# Altium schematic sheet Root.SchDoc
size B
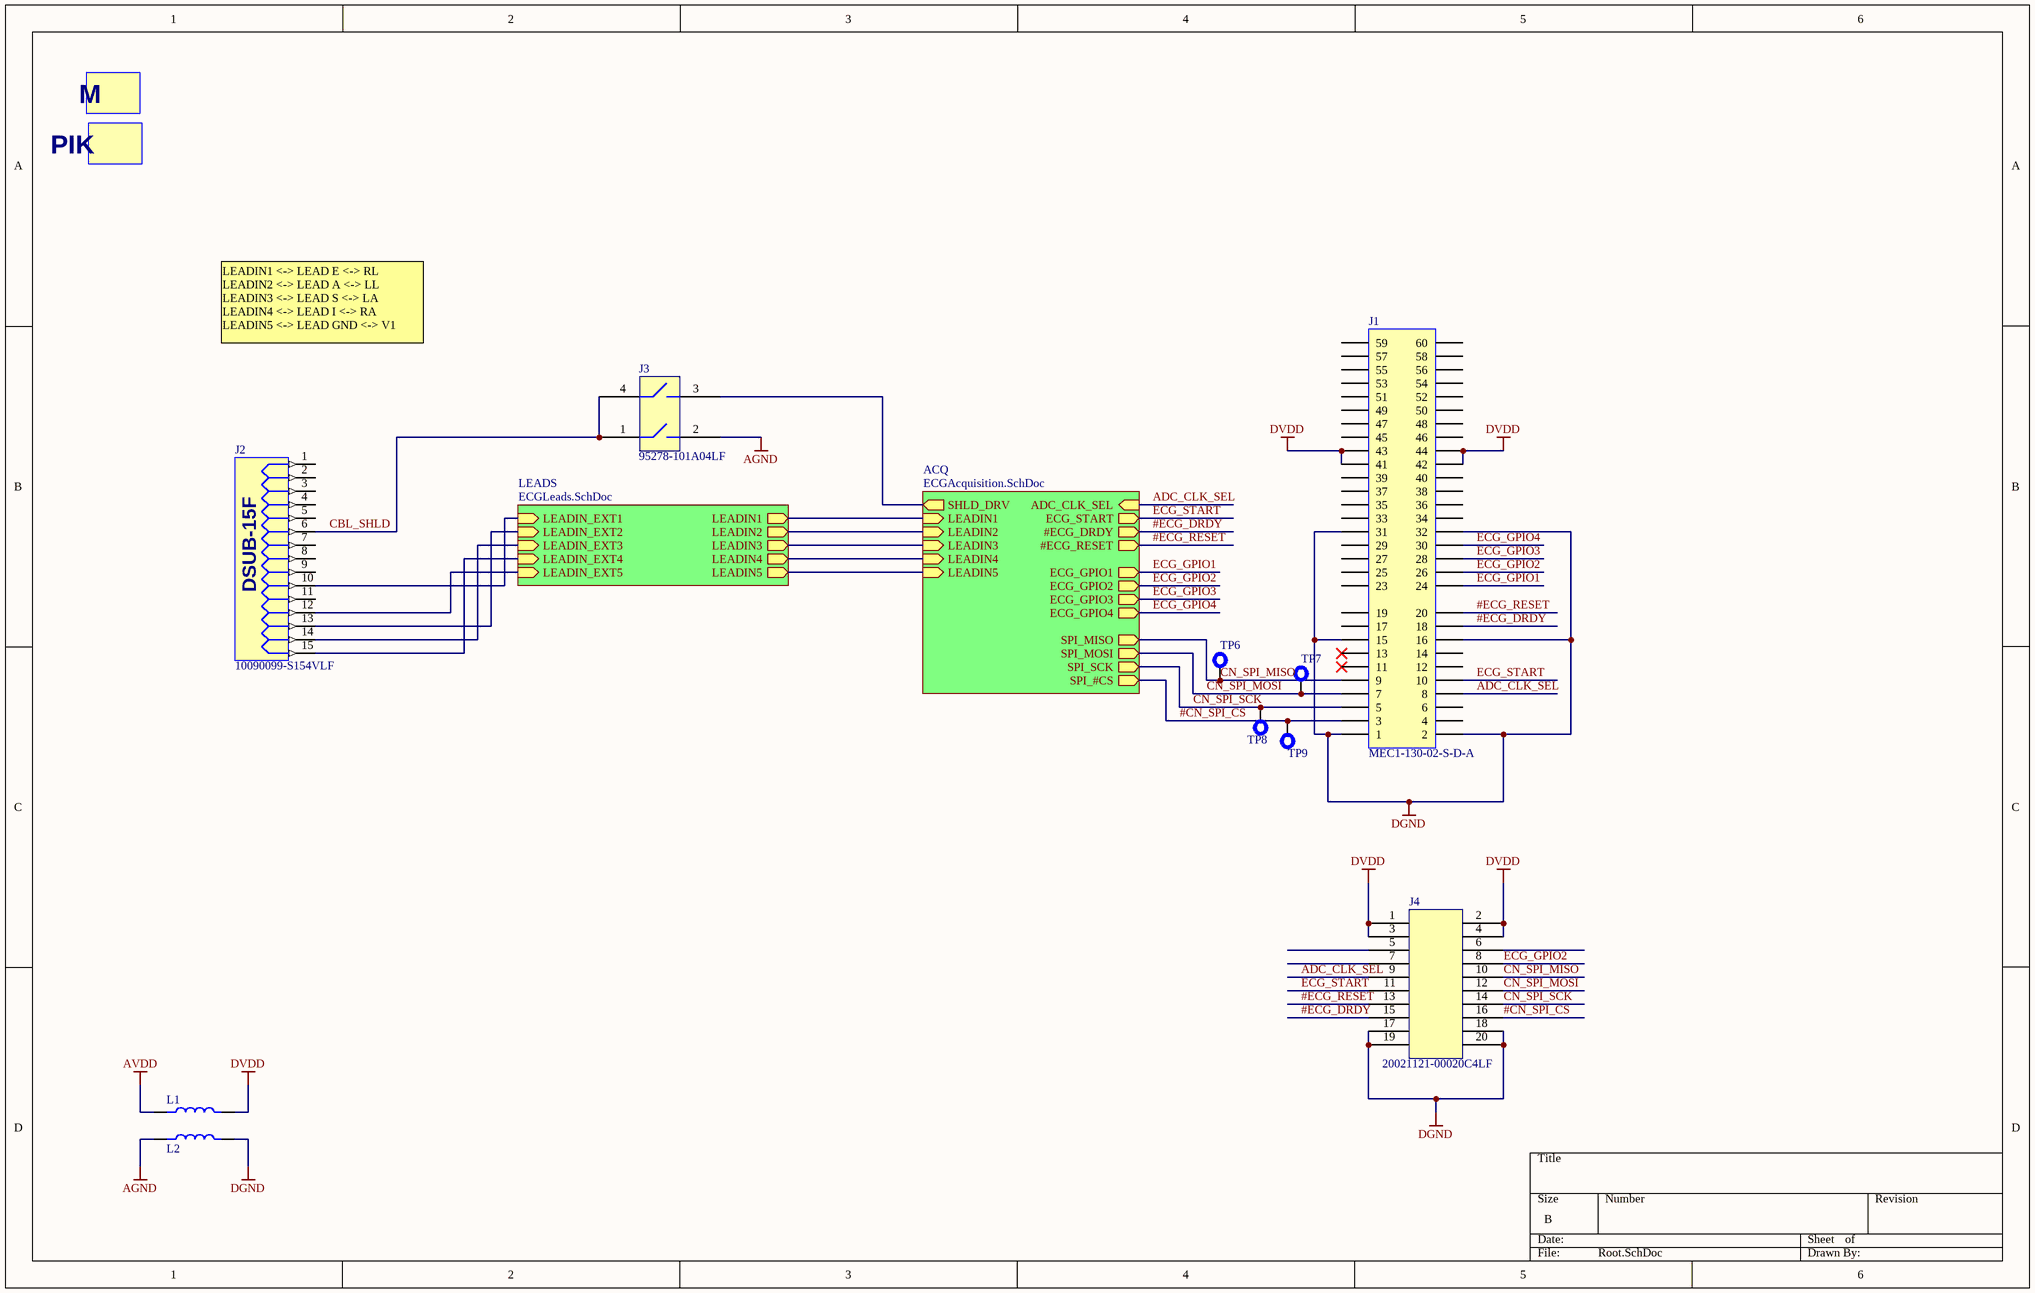
[diagram p0: Root.SchDoc]

## Parts
J1  MEC1-130-02-S-D-A  [MEC1-130-02-S-D-A]
J2  10090099-S154VLF  [10090099-S154VLF]
J3  95278-101A04LF  [95278-101A04LF]
J4  20021121-00020C4LF  [20021121-00020C4LF]
L1  IND_GEN  [IND_0603]  (value not drawn)
L2  IND_GEN  [IND_0603]  (value not drawn)
OV1  MINNESOTA_OVERLAY  [Minnesota]  (value not drawn)
OV2  PIKACHU_OVERLAY  [PIKACHU]  (value not drawn)
TP6  TEST_PT_40MIL  [TP_40MIL]  (value not drawn)
TP7  TEST_PT_40MIL  [TP_40MIL]  (value not drawn)
TP8  TEST_PT_40MIL  [TP_40MIL]  (value not drawn)
TP9  TEST_PT_40MIL  [TP_40MIL]  (value not drawn)

## Sub-sheets
ACQ = ECGAcquisition.SchDoc: SPI_MISO (out), SPI_SCK (out), SPI_#CS (out), SPI_MOSI (out), ADC_CLK_SEL (in), ECG_START (out), #ECG_DRDY (out), #ECG_RESET (out), ECG_GPIO1 (out), ECG_GPIO2 (out), ECG_GPIO3 (out), ECG_GPIO4 (out), LEADIN2 (in), LEADIN3 (in), LEADIN4 (in), LEADIN1 (in), LEADIN5 (in), SHLD_DRV (out)
LEADS = ECGLeads.SchDoc: LEADIN_EXT1 (in), LEADIN_EXT2 (in), LEADIN_EXT3 (in), LEADIN_EXT4 (in), LEADIN_EXT5 (in), LEADIN1 (out), LEADIN2 (out), LEADIN3 (out), LEADIN4 (out), LEADIN5 (out)

## Nets
AGND: J3.2 L2.1
AVDD: L1.1
DGND: J1.1 J1.2 J1.15 J1.16 J1.31 J1.32 J4.17 J4.18 J4.19 J4.20 L2.2
DVDD: J1.41 J1.42 J1.43 J1.44 J4.1 J4.2 J4.3 J4.4 L1.2
#CN_SPI_CS: J1.3 J4.16 TP9.1 ; sheet ACQ/SPI_#CS
#ECG_DRDY: J1.18 J4.15 ; sheet ACQ/#ECG_DRDY
#ECG_RESET: J1.20 J4.13 ; sheet ACQ/#ECG_RESET
ADC_CLK_SEL: J1.8 J4.9 ; sheet ACQ/ADC_CLK_SEL
CBL_SHLD: J2.6 J3.1 J3.4
CN_SPI_MISO: J1.9 J4.10 TP6.1 ; sheet ACQ/SPI_MISO
CN_SPI_MOSI: J1.7 J4.12 TP7.1 ; sheet ACQ/SPI_MOSI
CN_SPI_SCK: J1.5 J4.14 TP8.1 ; sheet ACQ/SPI_SCK
ECG_GPIO1: J1.24 ; sheet ACQ/ECG_GPIO1
ECG_GPIO2: J1.26 J4.8 ; sheet ACQ/ECG_GPIO2
ECG_GPIO3: J1.28 ; sheet ACQ/ECG_GPIO3
ECG_GPIO4: J1.30 ; sheet ACQ/ECG_GPIO4
ECG_START: J1.10 J4.11 ; sheet ACQ/ECG_START
NetJ2_10: J2.10 ; sheet LEADS/LEADIN_EXT1
NetJ2_12: J2.12 ; sheet LEADS/LEADIN_EXT5
NetJ2_13: J2.13 ; sheet LEADS/LEADIN_EXT2
NetJ2_14: J2.14 ; sheet LEADS/LEADIN_EXT3
NetJ2_15: J2.15 ; sheet LEADS/LEADIN_EXT4
NetJ3_3: J3.3 ; sheet ACQ/SHLD_DRV
(unnamed): sheet LEADS/LEADIN1, sheet ACQ/LEADIN1
(unnamed): sheet LEADS/LEADIN2, sheet ACQ/LEADIN2
(unnamed): sheet LEADS/LEADIN3, sheet ACQ/LEADIN3
(unnamed): sheet LEADS/LEADIN4, sheet ACQ/LEADIN4
(unnamed): sheet LEADS/LEADIN5, sheet ACQ/LEADIN5

Not connected (* = marked no-connect by the designer): J1 4 6 11* 12 13* 14 17 19 23 25 27 29 33 34 35 36 37 38 39 40 45 46 47 48 49 50 51 52 53 54 55 56 57 58 59 60; J2 1 2 3 4 5 7 8 9 11; J4 5(3) 6(4) 7(4)

## Notes on the sheet
- LEADIN1 <-> LEAD E <-> RL
  LEADIN2 <-> LEAD A <-> LL
  LEADIN3 <-> LEAD S <-> LA
  LEADIN4 <-> LEAD I <-> RA
  LEADIN5 <-> LEAD GND <-> V1
- (in symbol 10090099-S154VLF) DSUB-15F
- (in symbol MINNESOTA_OVERLAY) M
- (in symbol PIKACHU_OVERLAY) PIK

## Library data of the parts
J1 = MEC1-130-02-S-D-A: CONN EDGE CARD DL 1MM 60POS SMD; Manufacturer: Samtec; Manufacturer Part Number: MEC1-130-02-S-D-A
J2 = 10090099-S154VLF: CONN DSUB RCPT 15POS R/A GOLD; Manufacturer: FCI; Manufacturer Part Number: 10090099-S154VLF
J3 = 95278-101A04LF: CONN HEADER 4POS .100" DL SMD; Manufacturer: FCI; Manufacturer Part Number: 95278-101A04LF
J4 = 20021121-00020C4LF: CONN HEADER 20POS DL UNSHRD SMD; Manufacturer: FCI; Manufacturer Part Number: 20021121-00020C4LF
L1 L2 = IND_GEN: Generic Inductor; Manufacturer: TDK Corporation; Manufacturer Part Number: MPZ1608Y151B; Value: ?
OV1 = MINNESOTA_OVERLAY: UOFM OVERLAY
OV2 = PIKACHU_OVERLAY: PIKACHU BOTTOM OVERLAY
TP6-TP9 = TEST_PT_40MIL: 40MIL DIAM TEST POINT